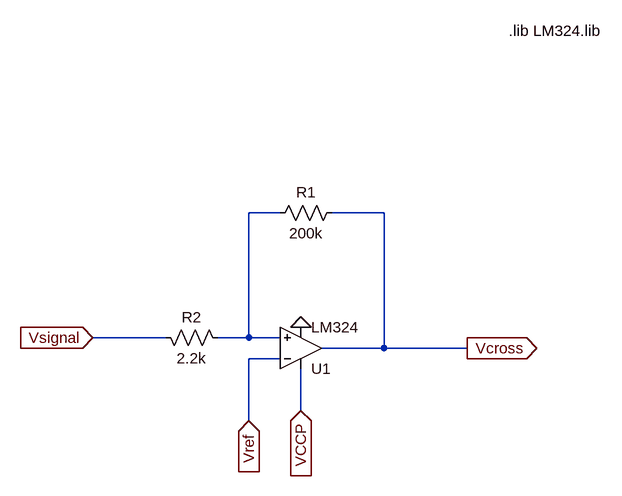
[diagram p0: schematic ZeroCrossing.asc]
ZeroCrossing.asc, the LTspice schematic file:
Version 4.1
SHEET 1 880 680
WIRE 48 -64 0 -64
WIRE 208 -64 128 -64
WIRE -128 128 -240 128
WIRE 0 128 0 -64
WIRE 0 128 -48 128
WIRE 48 128 0 128
WIRE 208 144 208 -64
WIRE 208 144 112 144
WIRE 336 144 208 144
WIRE 48 160 0 160
WIRE 80 240 80 176
WIRE 0 256 0 160
FLAG 0 256 Vref
IOPIN 0 256 In
FLAG -240 128 Vsignal
IOPIN -240 128 In
FLAG 80 112 0
FLAG 80 240 VCCP
IOPIN 80 240 In
FLAG 336 144 Vcross
IOPIN 336 144 Out
SYMBOL OpAmps\\opamp2 80 208 M180
SYMATTR InstName U1
SYMATTR Value LM324
SYMBOL res -144 112 M90
WINDOW 0 0 56 VBottom 2
WINDOW 3 32 56 VTop 2
SYMATTR InstName R2
SYMATTR Value 2.2k
SYMBOL res 144 -80 R90
WINDOW 0 0 56 VBottom 2
WINDOW 3 32 56 VTop 2
SYMATTR InstName R1
SYMATTR Value 200k
TEXT 400 -344 Left 2 !.lib LM324.lib

The netlist it stands for:
* ZeroCrossing.asc
X§U1 N001 Vref VCCP 0 Vcross LM324  ; pins In+ In- V+ V- OUT
R2 Vsignal N001 2.2k
R1 Vcross N001 200k
.lib LM324.lib
.backanno
.end